# Altium schematic sheet demo_dermis_main_testboard_back.SchDoc
size E
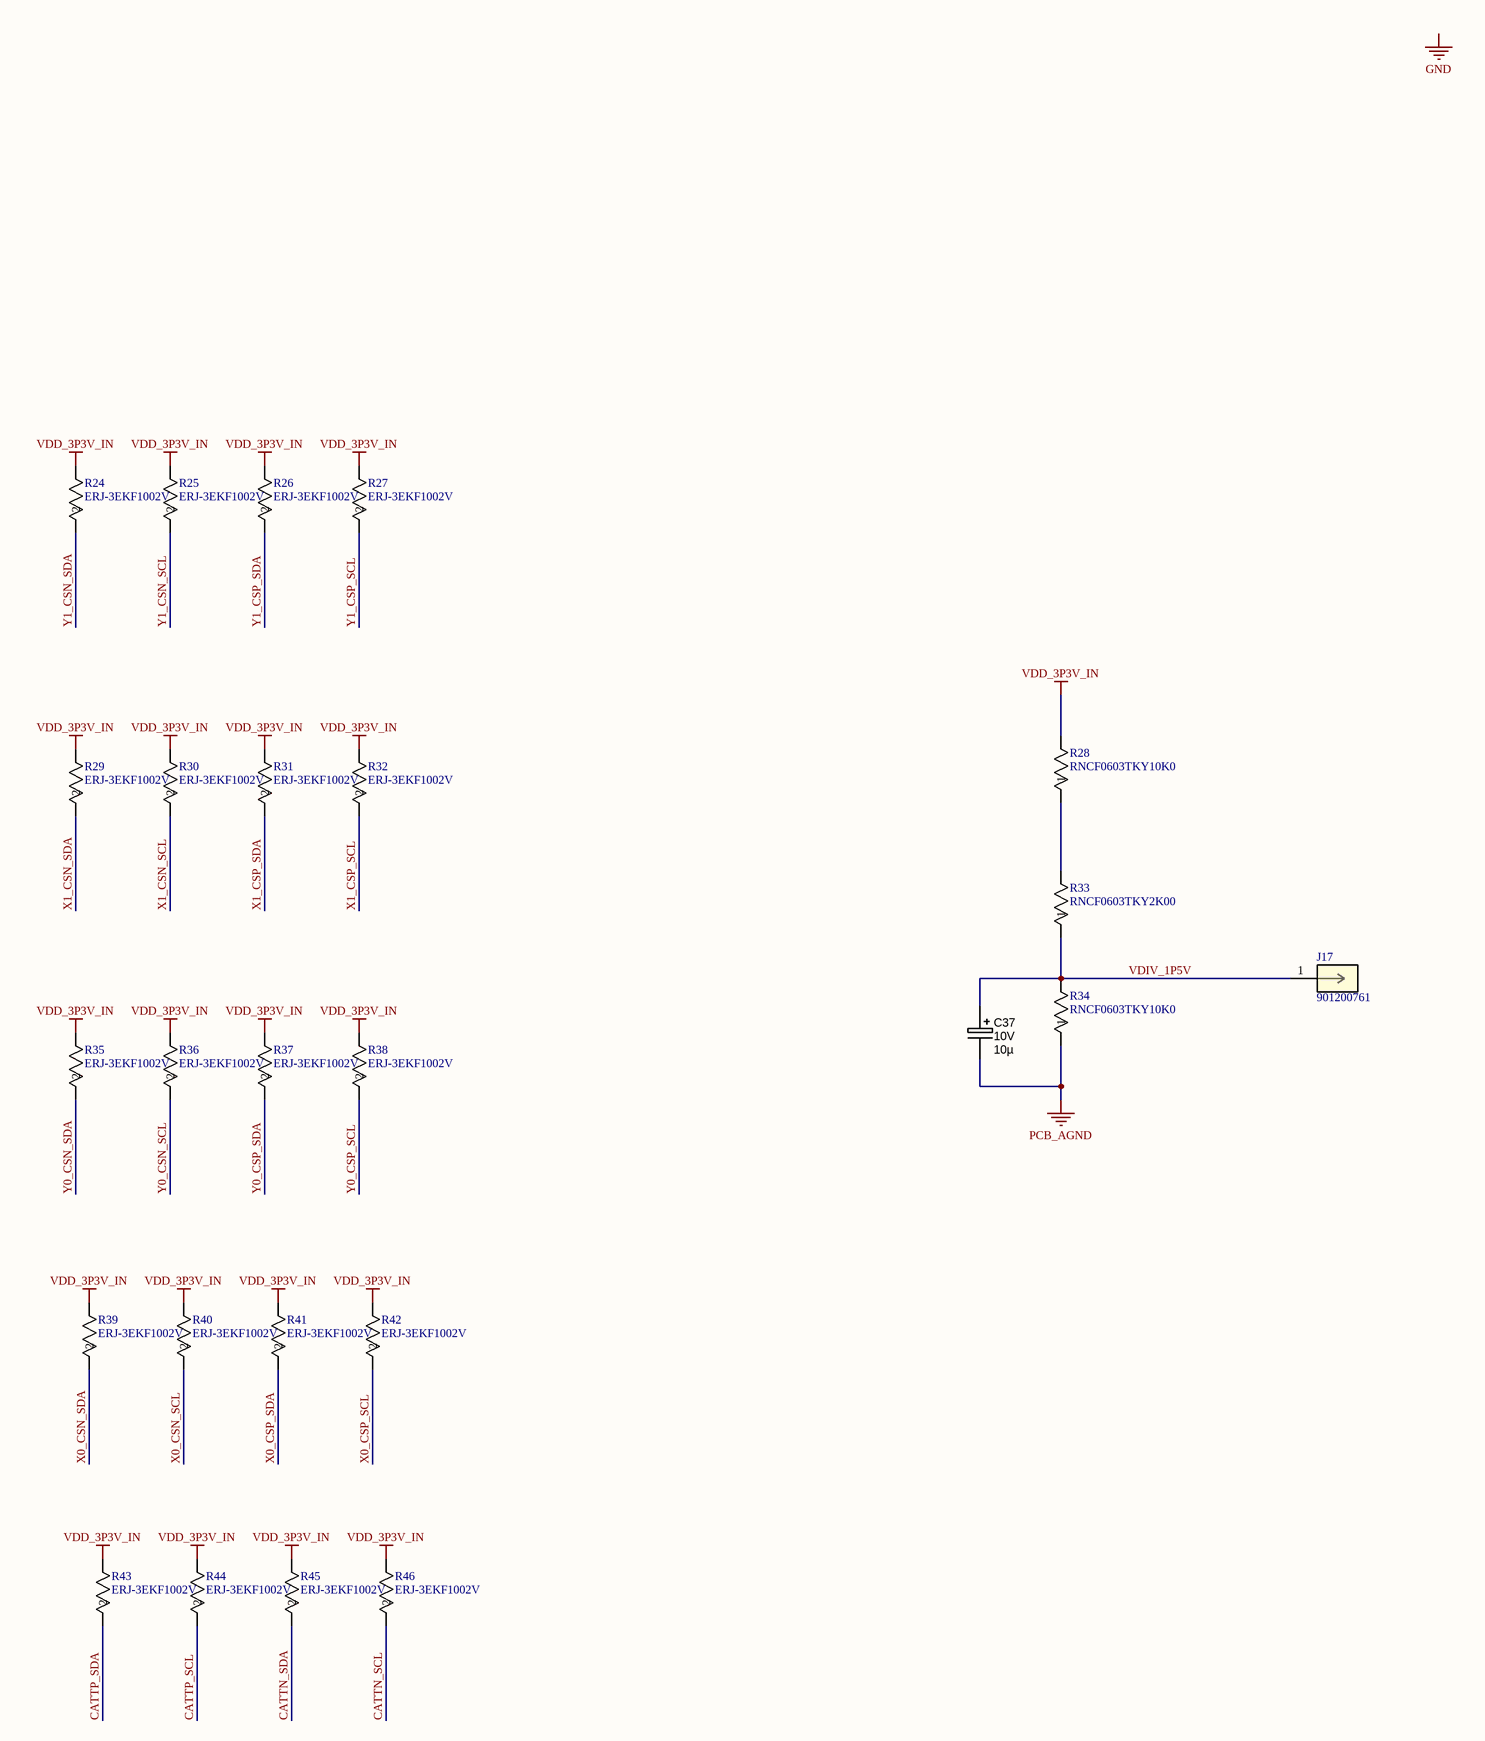
[diagram p0: demo_dermis_main_testboard_back.SchDoc]

## Parts
C37  Ratings: 10V  [CAPMP2012X150USR]  (hidden comment: 10µ)
J17  901200761  [CONN_90120-0761_MOL]
R24  ERJ-3EKF1002V  [RC0603N_PAN]
R25  ERJ-3EKF1002V  [RC0603N_PAN]
R26  ERJ-3EKF1002V  [RC0603N_PAN]
R27  ERJ-3EKF1002V  [RC0603N_PAN]
R28  RNCF0603TKY10K0  [STA_RNCF0603_STP]
R29  ERJ-3EKF1002V  [RC0603N_PAN]
R30  ERJ-3EKF1002V  [RC0603N_PAN]
R31  ERJ-3EKF1002V  [RC0603N_PAN]
R32  ERJ-3EKF1002V  [RC0603N_PAN]
R33  RNCF0603TKY2K00  [RES_RNCF0603_STP]
R34  RNCF0603TKY10K0  [STA_RNCF0603_STP]
R35  ERJ-3EKF1002V  [RC0603N_PAN]
R36  ERJ-3EKF1002V  [RC0603N_PAN]
R37  ERJ-3EKF1002V  [RC0603N_PAN]
R38  ERJ-3EKF1002V  [RC0603N_PAN]
R39  ERJ-3EKF1002V  [RC0603N_PAN]
R40  ERJ-3EKF1002V  [RC0603N_PAN]
R41  ERJ-3EKF1002V  [RC0603N_PAN]
R42  ERJ-3EKF1002V  [RC0603N_PAN]
R43  ERJ-3EKF1002V  [RC0603N_PAN]
R44  ERJ-3EKF1002V  [RC0603N_PAN]
R45  ERJ-3EKF1002V  [RC0603N_PAN]
R46  ERJ-3EKF1002V  [RC0603N_PAN]

## Nets
PCB_AGND: C37.2 R34.1
VDD_3P3V_IN: R24.1 R25.1 R26.1 R27.1 R28.2 R29.1 R30.1 R31.1 R32.1 R35.1 R36.1 R37.1 R38.1 R39.1 R40.1 R41.1 R42.1 R43.1 R44.1 R45.1 R46.1
CATTN_SCL: R46.2
CATTN_SDA: R45.2
CATTP_SCL: R44.2
CATTP_SDA: R43.2
VDIV_1P5V: C37.1 J17.1 R33.1 R34.2
X0_CSN_SCL: R40.2
X0_CSN_SDA: R39.2
X0_CSP_SCL: R42.2
X0_CSP_SDA: R41.2
X1_CSN_SCL: R30.2
X1_CSN_SDA: R29.2
X1_CSP_SCL: R32.2
X1_CSP_SDA: R31.2
Y0_CSN_SCL: R36.2
Y0_CSN_SDA: R35.2
Y0_CSP_SCL: R38.2
Y0_CSP_SDA: R37.2
Y1_CSN_SCL: R25.2
Y1_CSN_SDA: R24.2
Y1_CSP_SCL: R27.2
Y1_CSP_SDA: R26.2
NetR28_1: R28.1 R33.2

## Notes on the sheet
- Labels drawn without touching a wire or pin: GND

## Library data of the parts
C37 = CAPT_10u_0805_10V: Capacitor SMD Tantalum 10uF 20% 10V 0805; Manufacturer 1: AVX Corporation; Manufacturer Part Number 1: TAJP106M010RNJ; Package / Case: 0805 (2012 metric); Tolerance: ±20%; Material: Tantalum; Supplier 1: Digi-Key; Supplier Part Number 1: 478-3281-1-ND; Value: 10µ
J17 = 901200761: No Description Available; Mfr_Name: Molex Connector Corporation; Copyright: Copyright (C) 2022 Ultra Librarian. All rights reserved.; Manufacturer_Part_Number: 901200761; RefDes: RefDes; Type: DEV
R24-R27 R29-R32 R35-R46 = ERJ-3EKF1002V: No Description Available; Mfr_Name: Panasonic
R28 R34 = RNCF0603TKY10K0: No Description Available; Mfr_Name: Stackpole International
R33 = RNCF0603TKY2K00: No Description Available; Mfr_Name: Stackpole International